# EAGLE design MicroPomodoro (EAGLE 8.6.0)
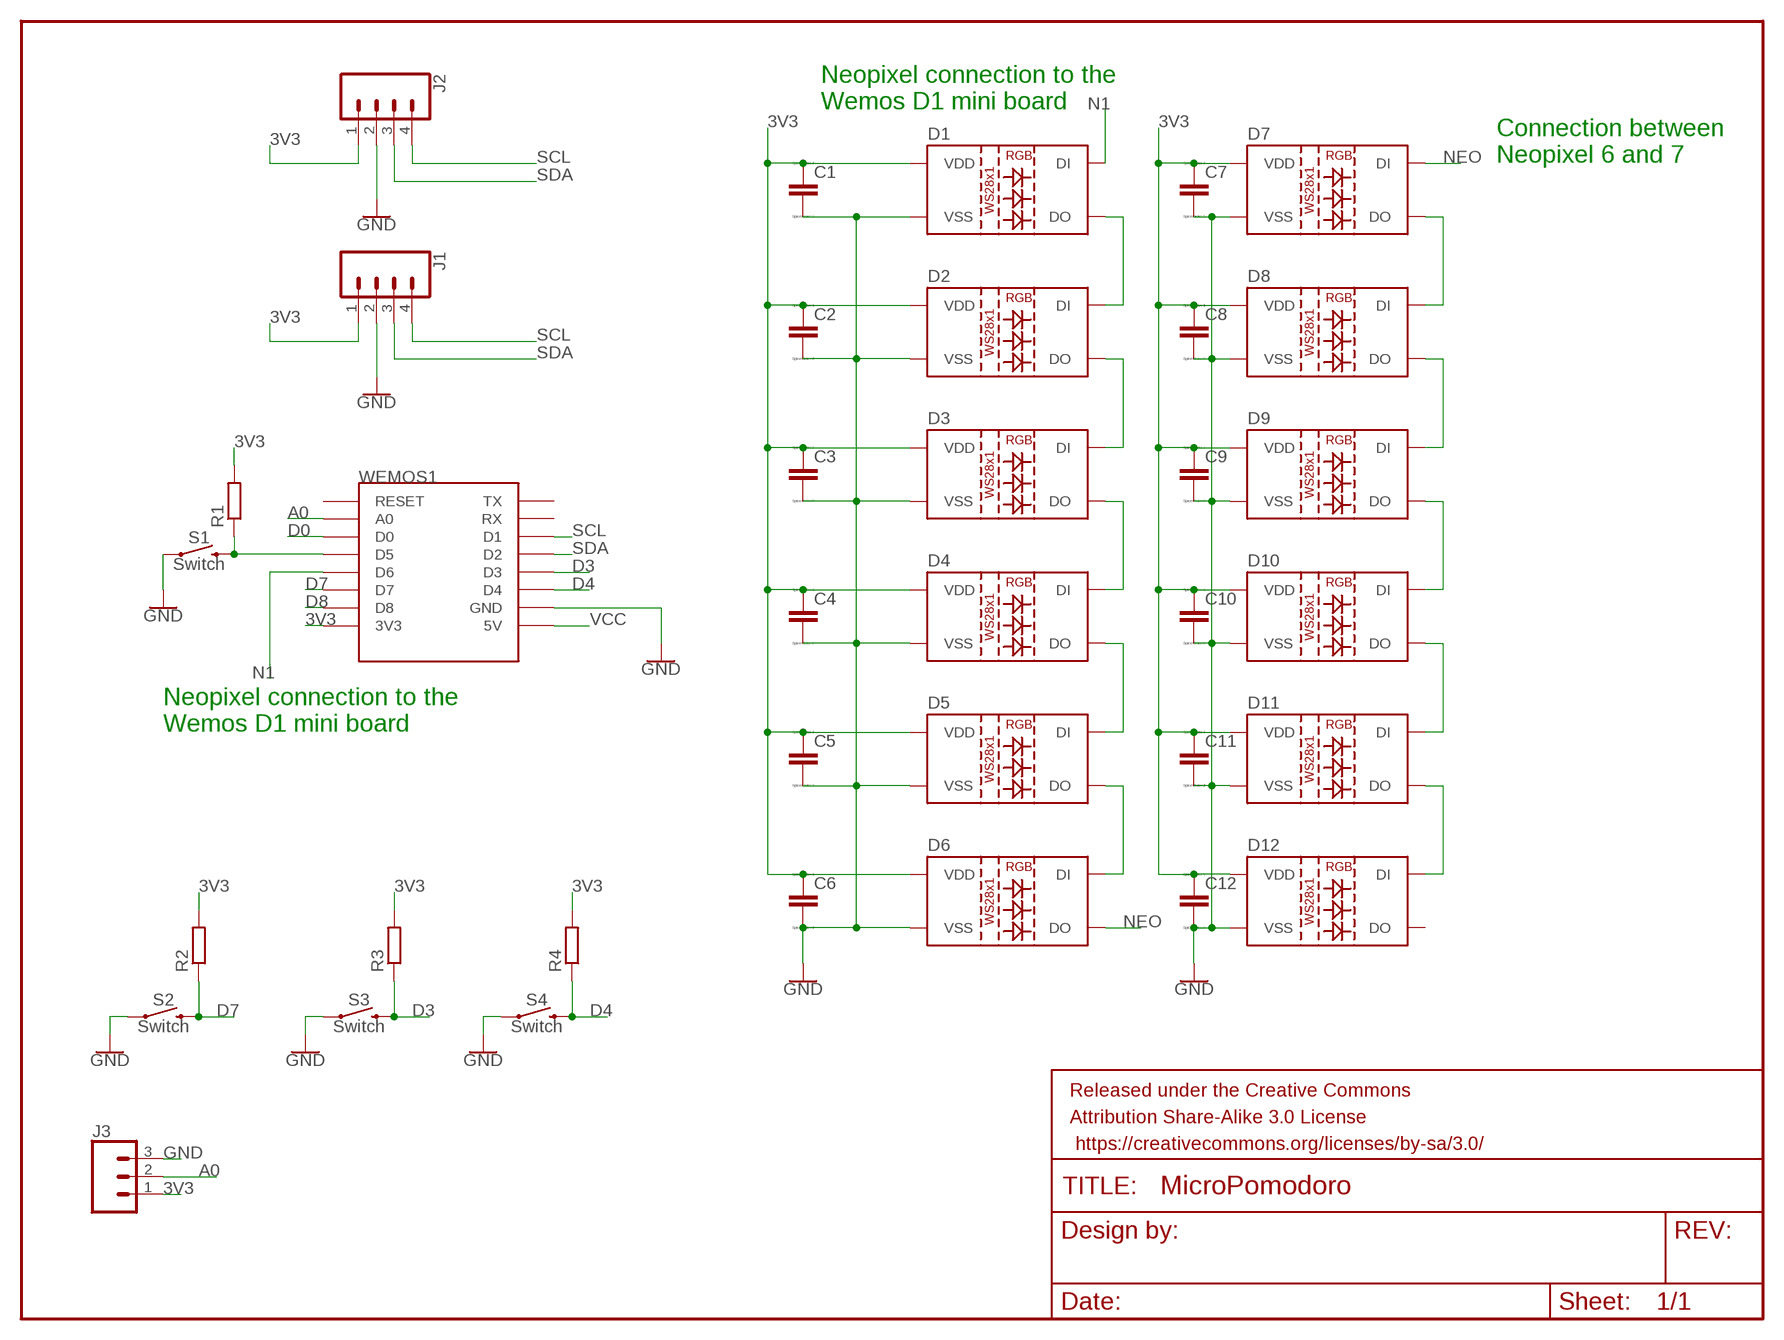
[diagram p0: schematic, sheet 1]

## Parts
C1  CC1206  [C1206]
C2  CC1206  [C1206]
C3  CC1206  [C1206]
C4  CC1206  [C1206]
C5  CC1206  [C1206]
C6  CC1206  [C1206]
C7  CC1206  [C1206]
C8  CC1206  [C1206]
C9  CC1206  [C1206]
C10  CC1206  [C1206]
C11  CC1206  [C1206]
C12  CC1206  [C1206]
D1  WS2812B  [WS2812B]
D2  WS2812B  [WS2812B]
D3  WS2812B  [WS2812B]
D4  WS2812B  [WS2812B]
D5  WS2812B  [WS2812B]
D6  WS2812B  [WS2812B]
D7  WS2812B  [WS2812B]
D8  WS2812B  [WS2812B]
D9  WS2812B  [WS2812B]
D10  WS2812B  [WS2812B]
D11  WS2812B  [WS2812B]
D12  WS2812B  [WS2812B]
FRAME1  FRAME-LETTER  [CREATIVE_COMMONS]
J1  CONN_04LONGPADS  [1X04_LONGPADS]
J2  CONN_04SMD_LONG  [1X04_SMD_LONG_NO_HOLE]
J3  CONN_03SMD_RA_MALE  [1X03_SMD_RA_MALE]
R1  R-EU_R1206  [R1206]
R2  R-EU_R1206  [R1206]
R3  R-EU_R1206  [R1206]
R4  R-EU_R1206  [R1206]
S1  Switch  MOMENTARY-SWITCH-SPST-PTH-6.0MM  [TACTILE_SWITCH_PTH_6.0MM]
S2  Switch  MOMENTARY-SWITCH-SPST-PTH-6.0MM  [TACTILE_SWITCH_PTH_6.0MM]
S3  Switch  MOMENTARY-SWITCH-SPST-PTH-6.0MM  [TACTILE_SWITCH_PTH_6.0MM]
S4  Switch  MOMENTARY-SWITCH-SPST-PTH-6.0MM  [TACTILE_SWITCH_PTH_6.0MM]
WEMOS1  WEMOS-D1-MINI  [WEMOS-D1-MINI]

## Nets
3V3: C1.1 C2.1 C3.1 C4.1 C5.1 C6.1 C7.1 C8.1 C9.1 C10.1 C11.1 C12.1 D1.1(VDD) D2.1(VDD) D3.1(VDD) D4.1(VDD) D5.1(VDD) D6.1(VDD) D7.1(VDD) D8.1(VDD) D9.1(VDD) D10.1(VDD) D11.1(VDD) D12.1(VDD) J1.1 J2.1 J3.1 R1.2 R2.2 R3.2 R4.2 WEMOS1.3V3
A0: J3.2 WEMOS1.A0
D0: WEMOS1.D0
D3: R3.1 S3.3 WEMOS1.D3
D4: R4.1 S4.3 WEMOS1.D4
D7: R2.1 S2.3 WEMOS1.D7
D8: WEMOS1.D8
GND: C1.2 C2.2 C3.2 C4.2 C5.2 C6.2 C7.2 C8.2 C9.2 C10.2 C11.2 C12.2 D1.3(VSS) D2.3(VSS) D3.3(VSS) D4.3(VSS) D5.3(VSS) D6.3(VSS) D7.3(VSS) D8.3(VSS) D9.3(VSS) D10.3(VSS) D11.3(VSS) D12.3(VSS) J1.2 J2.2 J3.3 S1.1 S2.1 S3.1 S4.1 WEMOS1.GND
N1: D1.4(DI) WEMOS1.D6
N$1: R1.1 S1.3 WEMOS1.D5
N$25: D1.2(DO) D2.4(DI)
N$26: D2.2(DO) D3.4(DI)
N$27: D3.2(DO) D4.4(DI)
N$28: D4.2(DO) D5.4(DI)
N$29: D5.2(DO) D6.4(DI)
N$30: D7.2(DO) D8.4(DI)
N$31: D8.2(DO) D9.4(DI)
N$32: D9.2(DO) D10.4(DI)
N$33: D10.2(DO) D11.4(DI)
N$34: D11.2(DO) D12.4(DI)
NEO: D6.2(DO) D7.4(DI)
SCL: J1.4 J2.4 WEMOS1.D1
SDA: J1.3 J2.3 WEMOS1.D2
VCC: WEMOS1.5V
Unconnected: D12.2(DO) WEMOS1.RESET WEMOS1.RX WEMOS1.TX

## Notes on the sheet
- Neopixel connection to the 
  Wemos D1 mini board
- Connection between 
  Neopixel 6 and 7
- Neopixel connection to the 
  Wemos D1 mini board

## Library data of the parts
C1-C12 = eagle-ltspice:C: CAPACITOR, European symbol; SPICEMODEL: NONE; SPICEPREFIX: C
D1-D12 = SparkFun-LED:WS2812B: WS2812B SMD addressable RGB LED 5x5mm SMD LED with built-in controller IC. Color: Red/Green/Blue mC Rating: RGB: 390, 660, 180 mcd Forward Voltage: RGB: 2.0, 3.0, 3.0 V Packages:WS2812B SparkFun Products: Blynk Board - ESP8266 <https://www.sparkfun.com/products/13794>; PROD_ID: DIO-12503; VALUE: WS2812B
FRAME1 = SparkFun-Retired:FRAME-LETTER: Schematic Frame Standard 8.5x11 US Letter frame
J1 = SparkFun-Connectors:CONN_04: Multi connection point. Often used as Generic Header-pin footprint for 0.1 inch spaced/style header connections On any of the 0.1 inch spaced packages, you can populate with these: Break Away Headers - Straight <https://www.sparkfun.com/products/116> (PRT-00116) Break Away Male Headers - Right Angle <https://www.sparkfun.com/products/553> (PRT-00553) Female Headers <https://www.sparkfun.com/products/115> (PRT-00115) Break Away Headers - Machine Pin <https://www.sparkfun.com/products/117> (PRT-00117) Break Away Female Headers - Swiss Machine Pin <https://www.sparkfun.com/products/743> (PRT-00743) For SCREWTERMINALS and SPRING TERMINALS visit here: Screw Terimnals on SparkFun.com <https://www.sparkfun.com/search/results?term=Screw+Terminals> (5mm/3.5mm/2.54mm spacing) This device is also useful as a general connection point to wire up your design to another part of your project. Our various solder wires solder well into these plated through hole pads. Hook-Up Wire - Assortment (Stranded, 22 AWG) <https://www.sparkfun.com/products/11375> (PRT-11375) Hook-Up Wire - Assortment (Solid Core, 22 AWG) <https://www.sparkfun.com/products/11367> (PRT-11367) View the entire wire category on our website here <https://www.sparkfun.com/categories/141> Special notes: Molex polarized connector foot print use with SKU : PRT-08231 with associated crimp pins and housings. 1MM SMD Version SKU: PRT-10208; PROD_ID: CONN-09696
J2 = SparkFun-Connectors:CONN_04: Multi connection point. Often used as Generic Header-pin footprint for 0.1 inch spaced/style header connections On any of the 0.1 inch spaced packages, you can populate with these: Break Away Headers - Straight <https://www.sparkfun.com/products/116> (PRT-00116) Break Away Male Headers - Right Angle <https://www.sparkfun.com/products/553> (PRT-00553) Female Headers <https://www.sparkfun.com/products/115> (PRT-00115) Break Away Headers - Machine Pin <https://www.sparkfun.com/products/117> (PRT-00117) Break Away Female Headers - Swiss Machine Pin <https://www.sparkfun.com/products/743> (PRT-00743) For SCREWTERMINALS and SPRING TERMINALS visit here: Screw Terimnals on SparkFun.com <https://www.sparkfun.com/search/results?term=Screw+Terminals> (5mm/3.5mm/2.54mm spacing) This device is also useful as a general connection point to wire up your design to another part of your project. Our various solder wires solder well into these plated through hole pads. Hook-Up Wire - Assortment (Stranded, 22 AWG) <https://www.sparkfun.com/products/11375> (PRT-11375) Hook-Up Wire - Assortment (Solid Core, 22 AWG) <https://www.sparkfun.com/products/11367> (PRT-11367) View the entire wire category on our website here <https://www.sparkfun.com/categories/141> Special notes: Molex polarized connector foot print use with SKU : PRT-08231 with associated crimp pins and housings. 1MM SMD Version SKU: PRT-10208; PROD_ID: CONN-09140; SF_ID: PRT-12638
J3 = SparkFun-Connectors:CONN_03: Multi connection point. Often used as Generic Header-pin footprint for 0.1 inch spaced/style header connections On any of the 0.1 inch spaced packages, you can populate with these: Break Away Headers - Straight <https://www.sparkfun.com/products/116> (PRT-00116) Break Away Male Headers - Right Angle <https://www.sparkfun.com/products/553> (PRT-00553) Female Headers <https://www.sparkfun.com/products/115> (PRT-00115) Break Away Headers - Machine Pin <https://www.sparkfun.com/products/117> (PRT-00117) Break Away Female Headers - Swiss Machine Pin <https://www.sparkfun.com/products/743> (PRT-00743) Stackable Header - 3 Pin (Female, 0.1") <https://www.sparkfun.com/products/13875> (PRT-13875) For SCREWTERMINALS and SPRING TERMINALS visit here: Screw Terimnals on SparkFun.com <https://www.sparkfun.com/search/results?term=Screw+Terminals> (5mm/3.5mm/2.54mm spacing) This device is also useful as a general connection point to wire up your design to another part of your project. Our various solder wires solder well into these plated through hole pads. Hook-Up Wire - Assortment (Stranded, 22 AWG) <https://www.sparkfun.com/products/11375> (PRT-11375) Hook-Up Wire - Assortment (Solid Core, 22 AWG) <https://www.sparkfun.com/products/11367> (PRT-11367) View the entire wire category on our website here <https://www.sparkfun.com/categories/141> Special notes: Molex polarized connector foot print use with SKU : PRT-08232 with associated crimp pins and housings.; PROD_ID: CONN-10925
R1-R4 = resistor:R-EU_: RESISTOR, European symbol
S1-S4 = SparkFun-Switches:MOMENTARY-SWITCH-SPST: Momentary Switch (Pushbutton) - SPST Normally-open (NO) SPST momentary switches (buttons, pushbuttons). Variants PTH-12MM - 12mm square, through-hole Momentary Pushbutton Switch - 12mm Square <https://www.sparkfun.com/products/9190> (COM-09190) PTH-6.0MM, PTH-6.0MM-KIT - 6.0mm square, through-hole Mini Pushbutton Switch <https://www.sparkfun.com/products/97> (COM-00097) KIT package intended for soldering kit's - only one side of pads' copper is exposed. PTH-RIGHT-ANGLE-KIT - Right-angle, through-hole Right Angle Tactile Button <https://www.sparkfun.com/products/10791> - Used on SparkFun BigTime Watch Kit <https://www.sparkfun.com/products/11734> SMD-12MM - 12mm square, surface-mount Tactile Button - SMD (12mm) <https://www.sparkfun.com/products/12993> (COM-12993) Used on SparkFun PicoBoard <https://www.sparkfun.com/products/11888> SMD-4.5MM - 4.5mm Square Trackball Switch Used on SparkFun Blackberry Trackballer Breakout <https://www.sparkfun.com/products/13169> SMD-4.6MMX2.8MM - 4.60mm x 2.80mm, surface mount Used on SparkFun SAMD21 Mini Breakout <https://www.sparkfun.com/products/13664> SMD-5.2MM, SMD-5.2-REDUNDANT - 5.2mm square, surface-mount Mini Pushbutton Switch - SMD <https://www.sparkfun.com/products/8720> (COM-08720) Used on Arduino Pro Mini <https://www.sparkfun.com/products/11114> REDUNDANT package connects both switch circuits together SMD-6.0X3.5MM - 6.0 x 3.5mm, surface mount Momentary Reset Switch SMD <https://www.sparkfun.com/products/8229> (COM-08229) SMD-6.2MM-TALL - 6.2mm square, surface mount Tactile Button - SMD (6mm) <https://www.sparkfun.com/products/12992> Used on SparkFun Digital Sandbox <https://www.sparkfun.com/products/12651> SMD-RIGHT-ANGLE - Right-angle, surface mount Used on SparkFun Block for Intel® Edison - Arduino <https://www.sparkfun.com/products/13036>; PROD_ID: SWCH-08441; SF_SKU: COM-00097
WEMOS1 = esp8266modules:WEMOS-D1-MINI: WeMos.cc D1 mini ESP8266 module

## Board
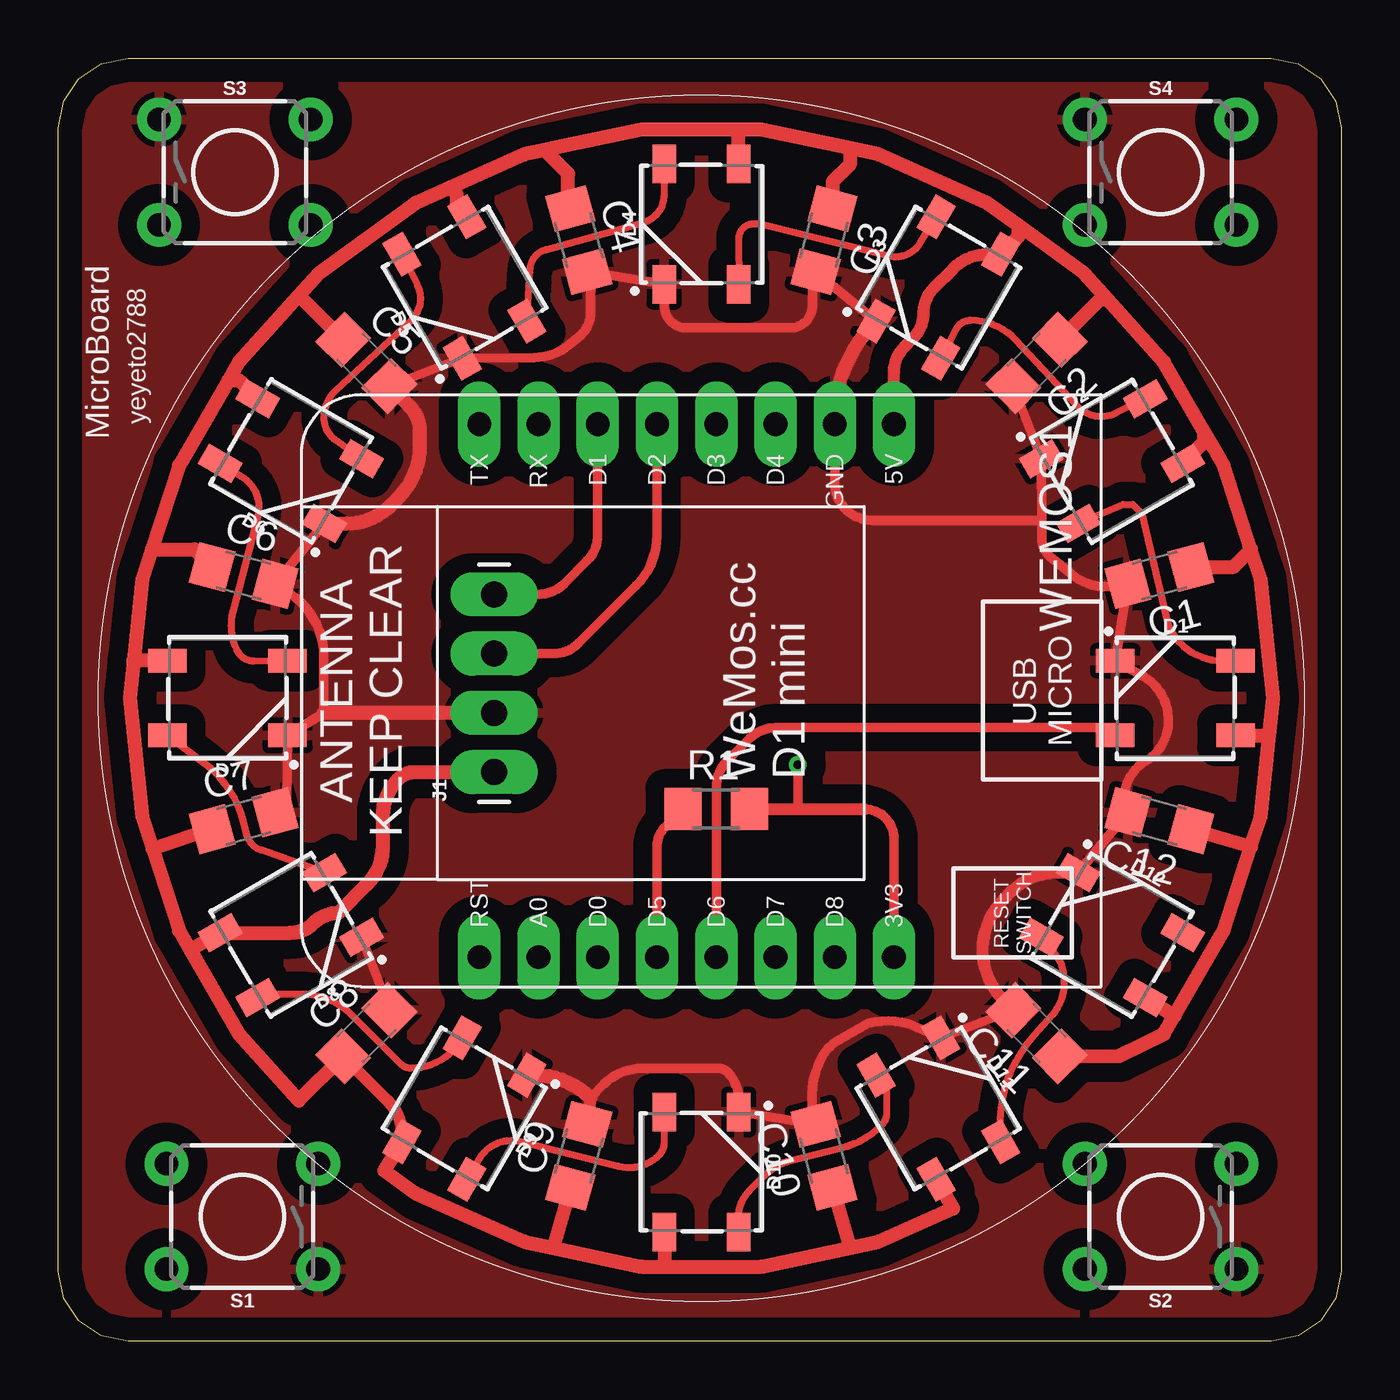
[diagram p1: board, top side]
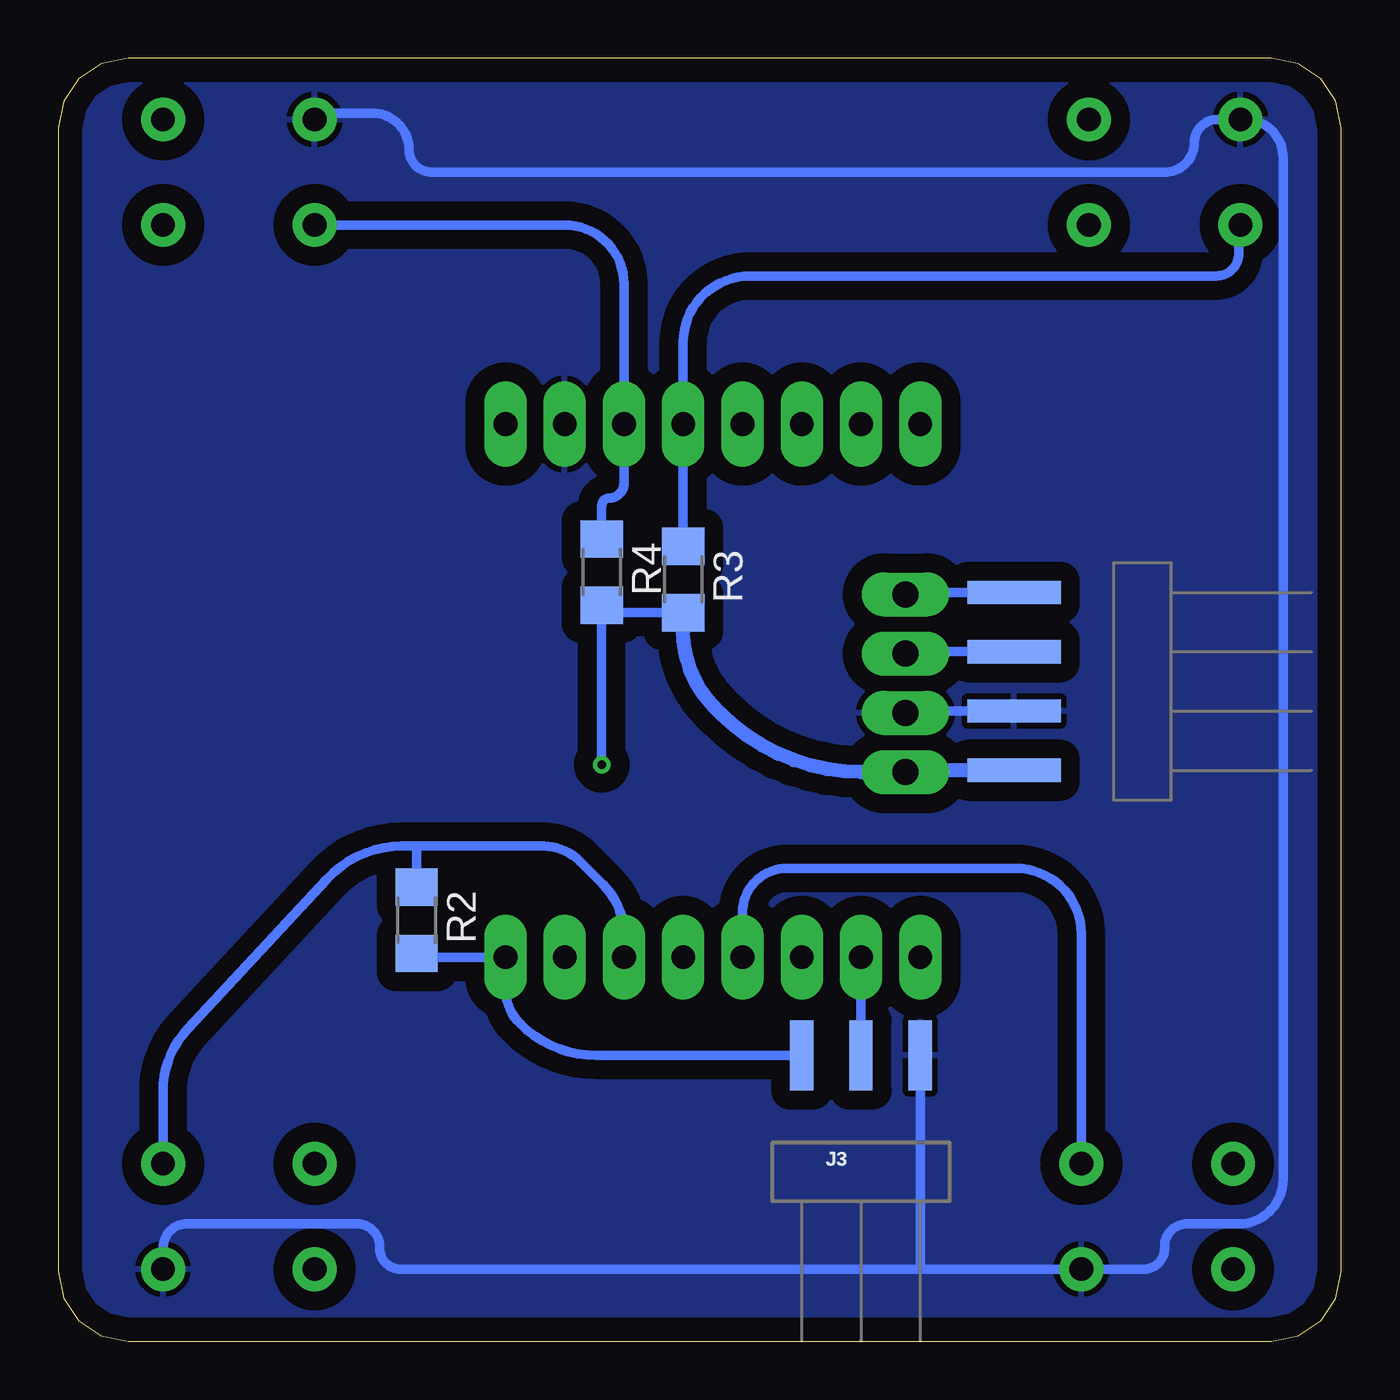
[diagram p2: board, bottom side, seen from below]

Size 55 x 55 mm. Coordinates in mm from the lower left corner, seen from the top.
Outline: 3,55 52,55 53.17,54.76 54.12,54.12 54.76,53.17 55,52 55,3 54.76,1.83 54.12,0.88 53.17,0.24 52,0 3,0 1.83,0.24 0.88,0.88 0.24,1.83 0,3 0,52 0.24,53.17 0.88,54.12 1.83,54.76 3,55
Copper layers (1*16): Top 0.035mm / dielectric 1.5mm / Bottom 0.035mm
Design rules "default": minimum track width 6mil, minimum drill 0.35mm, track to track 6mil, track to pad 6mil, pad to pad 6mil, via to via 6mil, smd to smd 6mil, copper to edge 40mil, drill to drill 6mil, minimum pad ring 10mil, minimum via ring 8mil, stop-mask expansion 4mil, vias tented up to drill 0mil, thermal gap 10mil

### Footprints (pad centres in the part's own frame; a part is rotated, then mirrored left to right if it is on the bottom)
C1206 = smd 1.6 x 1.8: 1 -1.4,0; 2 1.4,0
WS2812B = smd 1.651 x 1: 1 2.577,-1.6; 2 2.577,1.6; 3 -2.577,1.6; 4 -2.577,-1.6
1X04_LONGPADS = drill 1.118 pad 1.88 long: 1 0,0; 2 2.54,0; 3 5.08,0; 4 7.62,0
1X04_SMD_LONG_NO_HOLE = smd 1 x 4: 1 -3.81,5.5; 2 -1.27,5.5; 3 1.27,5.5; 4 3.81,5.5
1X03_SMD_RA_MALE = smd 1 x 3: 1 -2.54,5; 2 0,5; 3 2.54,5
R1206 = smd 1.6 x 1.803: 1 -1.422,0; 2 1.422,0
TACTILE_SWITCH_PTH_6.0MM = drill 1.016 pad 1.88: 1 -3.251,2.261; 2 3.251,2.261; 3 -3.251,-2.261; 4 3.251,-2.261
WEMOS-D1-MINI = drill 1.016 pad 1.829 long: 3V3 -10.16,-10.16; 5V 12.7,-10.16; A0 -10.16,5.08; D0 -10.16,2.54; D1 12.7,2.54; D2 12.7,0; D3 12.7,-2.54; D4 12.7,-5.08; D5 -10.16,0; D6 -10.16,-2.54; D7 -10.16,-5.08; D8 -10.16,-7.62; GND 12.7,-7.62; RESET -10.16,7.62; RX 12.7,5.08; TX 12.7,7.62

### Placement (x,y rotation side)
C1  47.2,32.83 195 top
C2  41.94,41.94 225 top
C3  32.83,47.2 255 top
C4  22.31,47.2 285 top
C5  13.2,41.94 315 top
C6  7.94,32.83 345 top
C7  7.94,22.31 15 top
C8  13.2,13.2 45 top
C9  22.31,7.94 75 top
C10  32.83,7.94 105 top
C11  41.94,13.2 135 top
C12  47.2,22.31 165 top
D1  47.89,27.57 0 top
D2  45.17,37.73 30 top
D3  37.73,45.17 60 top
D4  27.57,47.89 90 top
D5  17.41,45.17 120 top
D6  9.97,37.73 150 top
D7  7.25,27.57 180 top
D8  9.97,17.41 210 top
D9  17.41,9.97 240 top
D10  27.57,7.25 270 top
D11  37.73,9.97 300 top
D12  45.17,17.41 330 top
FRAME1  16.78,-11.8 0 top  (outside the outline)
J1  18.68,24.4 90 top
J2  8.52,28.29 90 bottom
J3  20.59,7.25 0 bottom
R1  28.21,22.81 0 top
R2  39.64,18.05 270 bottom
R3  28.21,32.65 270 bottom
R4  31.7,32.97 270 bottom
S1  7.89,5.35 180 top
S2  47.26,5.35 180 top
S3  7.57,50.12 0 top
S4  47.26,50.12 0 top
WEMOS1  25.67,26.62 90 top

### Tracks (layer width: path | path; a pad name or v marks a point on that pad's centre or on a via)
3V3  (via drill 0.35)
  Top 0.406: 34.56,22.81 arc-90 35.83,21.54 WEMOS1.3V3 | v31.7,24.71 31.7,22.81
  Top 0.508: R1.2 31.7,22.81 34.56,22.81 | C8.1 14.12,10.31 arc-45 14.74,8.81 D9.1
  Top 0.61: 51.13,33.94 51.55,32.67 52.08,27.57 51.92,26 | 51.13,33.94 49.96,37.54 49.49,38.37 49.13,38.98 | 49.13,38.98 47.4,41.98 44.98,44.67 | 44.98,44.67 43.97,45.79 41.17,47.82 | 41.17,47.82 39.83,48.8 35.15,50.88 33.94,51.14 | 33.94,51.14 30.13,51.95 29.16,51.95 | 29.16,51.95 25.01,51.95 21.21,51.14 20.84,51.06 | 20.84,51.06 20,50.88 16.79,49.45 | 16.79,49.45 15.32,48.8 11.17,45.79 10.31,44.83 | 10.31,44.83 7.74,41.98 7.29,41.2 | 7.29,41.2 5.18,37.54 4.01,33.94 | 4.01,33.94 3.6,32.67 3.23,29.18 | 3.23,29.18 3.06,27.57 3.6,22.48 4.04,21.11 | 4.04,21.11 5.18,17.6 5.66,16.77 | 5.66,16.77 7.74,13.17 10.31,10.32 C8.1 | 21.21,4 20,4.26 15.32,6.35 13.97,7.32 D9.1 | 21.21,4 25.01,3.2 25.98,3.2 | 25.98,3.2 30.13,3.2 33.94,4 | 33.94,4 35.15,4.26 38.36,5.69 D11.1 | 47.85,13.94 47.4,13.17 45.47,12.22 C11.1 | 47.85,13.94 49.96,17.6 51.13,21.2 | 51.13,21.2 51.55,22.48 51.92,26 | D7.1 3.23,29.18 | C7.1 4.04,21.11 | 5.66,16.77 D8.1 9.95,17.51 arc45 10.93,17.92 arc-45 12.01,18.37 13.25,19.6 arc45 13.92,21.22 13.92,22.49 arc-45 14.59,24.12 arc-45 15.27,24.4 J1.1 | C9.1 21.21,4 | D10.1 25.98,3.2 | C10.1 33.94,4 | D12.1 47.85,13.94 | C12.1 51.13,21.2 | 33.94,51.14 33.94,50.45 33.19,49.7 C3.1 | D4.1 29.16,51.95 | C4.1 21.86,48.65 21.86,50.04 20.84,51.06 | D3.1 41.17,47.37 41.17,47.82 | D5.1 17.09,48.62 17.09,49.15 16.79,49.45 | C5.1 10.32,44.83 10.31,44.83 | C2.1 44.67,44.67 44.98,44.67 | D2.1 49.13,38.56 49.13,38.98 | C1.1 50.38,33.19 51.13,33.94 | D1.1 51.89,25.97 51.92,26 | 7.29,41.2 7.75,41.2 D6.1 | 4.01,33.94 5.84,33.94 C6.1
  Bottom 0.406: J3.1 31.93,12.25 arc45 35.19,13.6 arc45 35.83,15.14 WEMOS1.3V3 39.47,16.46 R2.2 | v31.7,24.71 R4.2 31.7,31.23 R3.2
  Bottom 0.61: J2.1 18.6,24.48 J1.1 20.57,24.4 arc45 26.56,26.88 26.86,27.18 arc45 28.21,30.43 R3.2
A0
  Bottom 0.406: WEMOS1.A0 J3.2
D3
  Bottom 0.406: S3.3 4.4,47.85 4.4,46.62 arc90 5.35,45.67 25.35,45.67 arc-90 28.21,42.81 WEMOS1.D3 R3.1
D4
  Bottom 0.406: S4.3 33.29,47.85 arc90 30.75,45.31 WEMOS1.D4 30.75,36.78 arc90 31.38,36.15 arc-90 31.7,35.83 R4.1
D7
  Bottom 0.406: WEMOS1.D7 30.75,17.41 arc-45 31.65,19.58 32.65,20.59 arc-45 34.19,21.22 39.64,21.22 | S2.3 50.51,10.71 arc43 49.46,13.39 43.47,19.83 arc47 40.27,21.22 39.64,21.22 | R2.1 39.64,21.22
GND
  Top 0.406: C7.2 9.79,23.13 D7.3 11.38,26.94 11.38,29.35 arc56 9.96,32.02 C6.2 D6.3 | D8.3 C8.2 | C11.2 D11.3 36.46,13.6 arc29 34.72,13.62 33.51,12.95 arc34 32.7,12.1 arc44 C10.2 D10.3 29.17,10.39 arc44 28.68,11.54 arc45 28.3,11.7 25.03,11.7 arc45 23.41,11.02 22.81,10.43 | C4.2 22.83,45.82 | 22.83,45.82 D4.3 25.98,45.32 25.98,44.4 arc90 26.94,43.45 31.38,43.45 arc90 32.33,44.4 32.33,45.85 C3.2 D3.3 | C2.2 41.21,40.27 D2.3 42.16,35.19 | 45.83,32.36 C1.2 45.85,32.35 44.97,32.35 | 45.83,32.36 D1.3 46.18,28.68 arc-60 47.57,26.93 arc-63 46.73,24.93 arc65 45.7,23.21 45.72,22.51 | C12.2 45.72,22.51 | 45.72,22.51 D12.3 | C5.2 D5.3 20.42,42.17 arc38 21.85,42.68 22.31,43.05 arc51 22.82,44.09 22.83,45.82 | 42.16,35.19 42.17,34.37 arc50 42.52,33.64 43.4,32.9 arc41 44.97,32.35 | 44.97,32.35 45.83,32.36 | WEMOS1.GND 33.29,36.8 arc90 34.9,35.19 42.16,35.19
  Top 0.508: 22.81,10.43 C9.2 | C11.2 40.54,14.61 arc-45 39.64,16.78 arc-45 40.54,18.95 40.91,19.32 arc-45 42.76,20.09 D12.3
  Top 0.61: D9.3 20.45,11.41 arc-45 22.81,10.43 | WEMOS1.GND 33.29,39.5 arc-45 35.03,43.71 D3.3 | D6.3 12.38,35.06 arc45 14.24,35.83 14.61,36.2 arc45 15.51,38.37 15.51,39 arc45 15.06,40.09 C5.2 | J1.2 11.38,26.94
  Bottom 0.406: J2.2 18.6,27.02 J1.2 | 18.05,3.09 S1.1 8.46,3.09 arc-90 7.57,3.98 7.57,4.08 arc90 6.62,5.03 4.4,5.03 arc-90 2.49,6.93 2.49,50.75 arc-90 4.12,52.38 S3.1 5.31,52.38 arc-90 6.3,51.38 arc90 7.57,50.12 39,50.12 arc90 39.96,51.07 arc-90 41.54,52.65 44.01,52.65 S4.1 | 18.05,3.09 J3.3 | 18.05,3.09 40.33,3.09 arc90 41.22,3.98 41.22,4.08 arc-90 42.18,5.03 49.48,5.03 arc-90 50.51,4 S2.1
  pour Top (isolate 0.813): -0.37,59.64 -0.69,-1 55.83,-1 55.83,59.64
  pour Bottom (isolate 0.813): -5.45,55.51 61.86,55.51 61.86,0.27 -5.45,0.27
N1
  Top 0.406: WEMOS1.D6 28.21,23.76 arc-45 28.66,24.85 29.66,25.85 arc-45 30.75,26.3 45.35,26.3 45.35,26.01 D1.4
N$1
  Top 0.406: WEMOS1.D5 25.67,21.22 arc-45 26,22.02 R1.1
  Bottom 0.406: S1.3 11.14,17.46 arc-90 13.95,20.27 23.76,20.27 arc-90 25.67,18.37 WEMOS1.D5
N$25
  Top 0.305: D1.2 49.92,29.17 arc-68 47.57,30.75 46.46,35.47 46.07,35.87 45.65,35.87 D2.4
N$26
  Top 0.305: D2.2 45.34,39.78 arc-73 43.69,40.09 41.06,42.92 arc47 39.11,43.76 arc62 38.49,43.39 D3.4
N$27
  Top 0.305: D3.2 36.93,47.06 arc-72 35.61,46.52 30.11,47.89 29.79,47.89 arc90 29.16,47.26 D4.4
N$28
  Top 0.305: D5.4 20.23,45.97 arc-71 20.9,46.8 25.07,47.96 arc75 25.98,49.16 D4.2
N$29
  Top 0.305: D5.2 15.38,45.29 arc-73 15.1,43.72 11.87,40.72 arc47 11.38,39.61 arc54 11.87,38.65 D6.4
N$30
  Top 0.305: D8.4 8.69,21.05 arc-56 8.08,21.72 7.94,22.27 arc39 6.35,24.7 D7.2
N$31
  Top 0.305: D9.4 17.19,12.81 arc-57 15.13,11.7 arc-45 14.69,11.88 12.6,13.97 arc45 10.43,14.87 9.16,14.87 D8.2
N$32
  Top 0.305: D9.2 18.08,7.86 arc-72 19.8,8.56 24.03,7.5 arc59 25.76,7.98 arc45 25.98,8.52 D10.4
N$33
  Top 0.305: D10.2 29.17,5.31 arc-46 29.64,6.46 30.26,7.08 arc-31 31.42,7.74 33.56,8.27 arc31 35.29,9.25 arc45 35.51,9.79 35.51,10.74 D11.4
N$34
  Top 0.305: D11.2 40.38,9.01 arc-45 41.86,13.14 42.63,14 arc42 43.13,15.31 43.13,15.45 arc40 42.68,16.67 D12.4
NEO
  Top 0.305: D6.2 7.87,37.06 arc-73 8.55,35.36 7.49,31.32 arc41 7.66,29.61 arc64 8.39,29.16 D7.4
SCL
  Top 0.406: WEMOS1.D1 23.13,34.56 arc-45 22.68,33.47 21.67,32.47 arc-45 20.59,32.02 J1.4
  Bottom 0.406: J2.4 18.6,32.1 J1.4
SDA
  Top 0.406: WEMOS1.D2 25.67,34.56 arc-45 24.77,32.39 22.31,29.93 arc-45 21.22,29.48 J1.3
  Bottom 0.406: J2.3 18.6,29.56 J1.3
VCC
  Top 0.508: WEMOS1.5V 35.83,41.54 arc-45 36.28,42.63 36.65,43 arc45 37.1,44.08 arc-45 37.55,45.17 38.37,45.99 arc-45 39.85,46.6

### Text on the board
tPlace: MicroBoard | yeyeto2788